# EAGLE design demo3d (EAGLE 5.11)
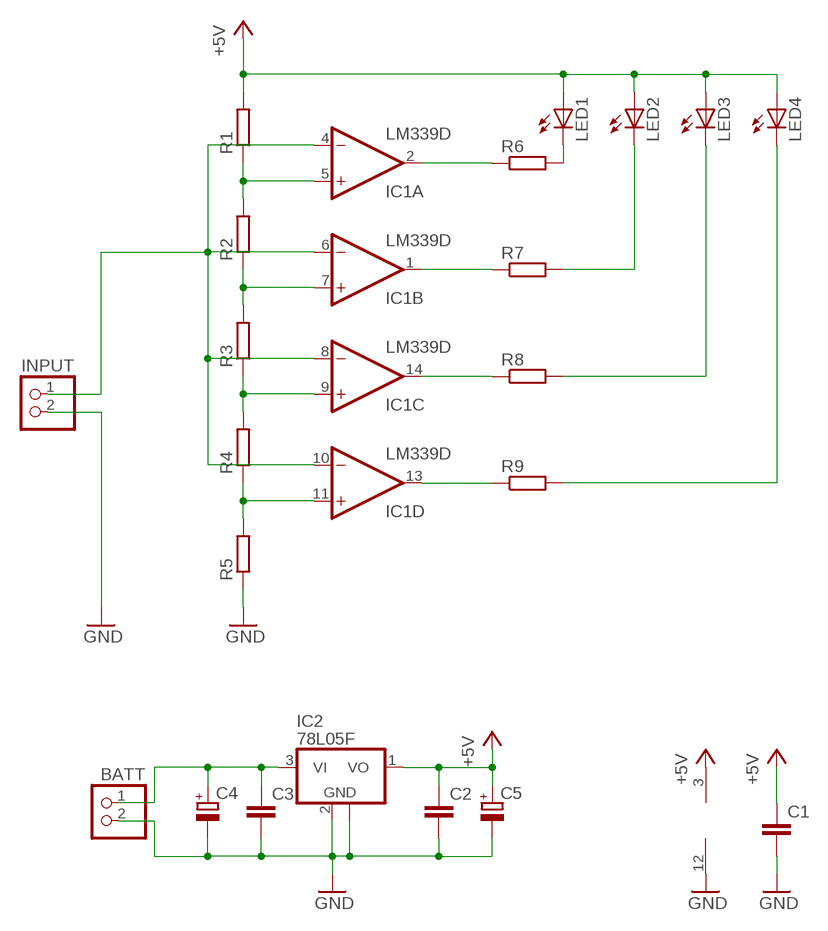
[diagram p0: schematic, sheet 1]

## Parts
BATT  PINHD-1X2  [1X02]
C1  C-EUC1206  [C1206]
C2  C-EUC1206  [C1206]
C3  C-EUC1206  [C1206]
C4  CPOL-EUE5-6  [E5-6]
C5  CPOL-EUE5-6  [E5-6]
IC1  LM339D  [SO14]
IC2  78L05F  [SOT89]
INPUT  PINHD-1X2  [1X02]
LED1  LED3MM  [LED3MM]
LED2  LED3MM  [LED3MM]
LED3  LED3MM  [LED3MM]
LED4  LED3MM  [LED3MM]
R1  R-EU_R1206  [R1206]
R2  R-EU_R1206  [R1206]
R3  R-EU_R1206  [R1206]
R4  R-EU_R1206  [R1206]
R5  R-EU_R1206  [R1206]
R6  R-EU_R1206  [R1206]
R7  R-EU_R1206  [R1206]
R8  R-EU_R1206  [R1206]
R9  R-EU_R1206  [R1206]

## Nets
+5V: C1.1 C2.1 C5.+ IC1.3(P:V+) IC2.1(VO) LED1.A LED2.A LED3.A LED4.A R1.2
GND: BATT.2 C1.2 C2.2 C3.2 C4.- C5.- IC1.12(P:GND) IC2.2(GND) IC2.2@1(GND) INPUT.2 R5.1
N$1: IC1.4(A:-IN) IC1.6(B:-IN) IC1.8(C:-IN) IC1.10(D:-IN) INPUT.1
N$2: IC1.11(D:+IN) R4.1 R5.2
N$3: IC1.9(C:+IN) R3.1 R4.2
N$4: IC1.7(B:+IN) R2.1 R3.2
N$5: IC1.5(A:+IN) R1.1 R2.2
N$6: IC1.1(B:OUT) R7.1
N$7: IC1.13(D:OUT) R9.1
N$8: IC1.14(C:OUT) R8.1
N$9: IC1.2(A:OUT) R6.1
N$10: LED1.K(C) R6.2
N$11: LED2.K(C) R7.2
N$12: LED3.K(C) R8.2
N$13: LED4.K(C) R9.2
N$16: BATT.1 C3.1 C4.+ IC2.3(VI)

## Library data of the parts
BATT INPUT = pinhead:PINHD-1X2: PIN HEADER
C1-C3 = rcl:C-EU: CAPACITOR, European symbol
C4 C5 = rcl:CPOL-EU: POLARIZED CAPACITOR, European symbol
IC1 = linear:LM339: Low Power Low Offset Voltage Quad Comparators with open collector; LM139/LM239/LM339/LM2901/LM3302
IC2 = linear:78L*: POSITOIV-VOLTAGE REGULATORS Output up to 100 mA Source: http://focus.ti.com/lit/ds/symlink/ua78l05.pdf
LED1-LED4 = led:LED: LED OSRAM: - CHIPLED LG R971, LG N971, LY N971, LG Q971, LY Q971, LO R971, LY R971 LH N974, LH R974 LS Q976, LO Q976, LY Q976 LO Q996 - Hyper CHIPLED LW Q18S LB Q993, LB Q99A, LB R99A - SideLED LS A670, LO A670, LY A670, LG A670, LP A670 LB A673, LV A673, LT A673, LW A673 LH A674 LY A675 LS A676, LA A676, LO A676, LY A676, LW A676 LS A679, LY A679, LG A679 - Hyper Micro SIDELED® LS Y876, LA Y876, LO Y876, LY Y876 LT Y87S - SmartLED LW L88C, LW L88S LB L89C, LB L89S, LG L890 LS L89K, LO L89K, LY L89K LS L896, LA L896, LO L896, LY L896 - TOPLED LS T670, LO T670, LY T670, LG T670, LP T670 LSG T670, LSP T670, LSY T670, LOP T670, LYG T670 LG T671, LOG T671, LSG T671 LB T673, LV T673, LT T673, LW T673 LH T674 LS T676, LA T676, LO T676, LY T676, LB T676, LH T676, LSB T676, LW T676 LB T67C, LV T67C, LT T67C, LS T67K, LO T67K, LY T67K, LW E67C LS E67B, LA E67B, LO E67B, LY E67B, LB E67C, LV E67C, LT E67C LW T67C LS T679, LY T679, LG T679 LS T770, LO T770, LY T770, LG T770, LP T770 LB T773, LV T773, LT T773, LW T773 LH T774 LS E675, LA E675, LY E675, LS T675 LS T776, LA T776, LO T776, LY T776, LB T776 LHGB T686 LT T68C, LB T68C - Hyper Mini TOPLED® LB M676 - Mini TOPLED Santana® LG M470 LS M47K, LO M47K, LY M47K Source: http://www.osram.convergy.de LUXEON: - LUMILED® LXK2-PW12-R00, LXK2-PW12-S00, LXK2-PW14-U00, LXK2-PW14-V00 LXK2-PM12-R00, LXK2-PM12-S00, LXK2-PM14-U00 LXK2-PE12-Q00, LXK2-PE12-R00, LXK2-PE12-S00, LXK2-PE14-T00, LXK2-PE14-U00 LXK2-PB12-K00, LXK2-PB12-L00, LXK2-PB12-M00, LXK2-PB14-N00, LXK2-PB14-P00, LXK2-PB14-Q00 LXK2-PR12-L00, LXK2-PR12-M00, LXK2-PR14-Q00, LXK2-PR14-R00 LXK2-PD12-Q00, LXK2-PD12-R00, LXK2-PD12-S00 LXK2-PH12-R00, LXK2-PH12-S00 LXK2-PL12-P00, LXK2-PL12-Q00, LXK2-PL12-R00 Source: www.luxeon.com KINGBRIGHT: KA-3528ASYC Source: www.kingbright.com
R1-R9 = rcl:R-EU_: RESISTOR, European symbol

## Board
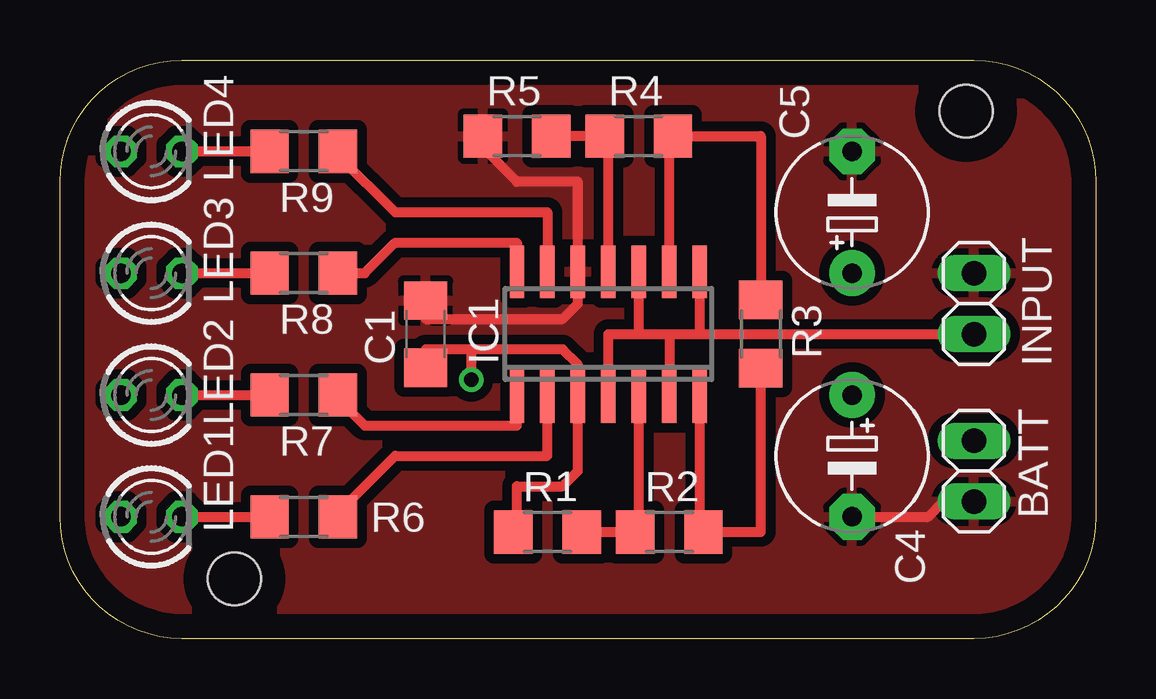
[diagram p1: board, top side]
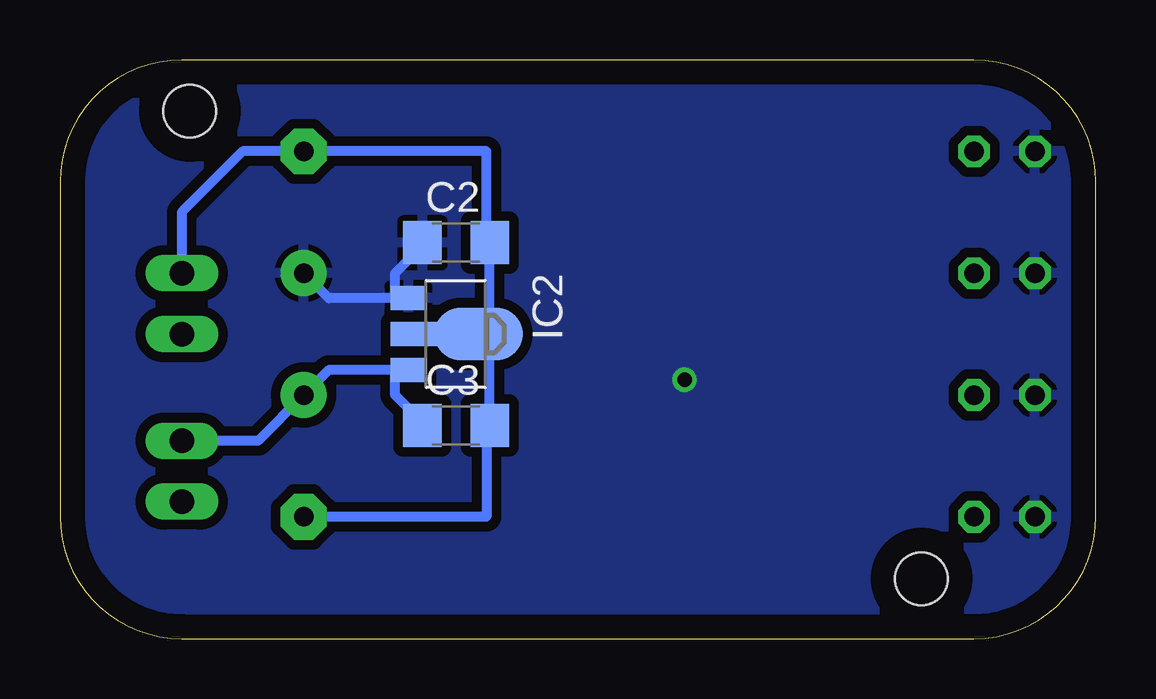
[diagram p2: board, bottom side, seen from below]

Size 43.18 x 24.13 mm. Coordinates in mm from the lower left corner, seen from the top.
Outline: 38.1,24.13 arc-90 43.18,19.05 43.18,5.08 arc-90 38.1,0 5.08,0 arc-90 0,5.08 0,19.05 arc-90 5.08,24.13 38.1,24.13
Copper layers (1*16): Top 0.035mm / dielectric 1.5mm / Bottom 0.035mm
Design rules "default": minimum track width 10mil, minimum drill 24mil, track to track 8mil, track to pad 8mil, pad to pad 8mil, via to via 8mil, smd to smd 8mil, copper to edge 40mil, drill to drill 8mil, minimum pad ring 10mil, minimum via ring 8mil, stop-mask expansion 4mil, vias tented up to drill 0mil, thermal gap 10mil
Holes 2.2 mm at 37.77,22 7.27,2.5

### Footprints (pad centres in the part's own frame; a part is rotated, then mirrored left to right if it is on the bottom)
1X02 = drill 1.016 long: 1 -1.27,0; 2 1.27,0
C1206 = smd 1.6 x 1.8: 1 -1.4,0; 2 1.4,0
E5-6 = drill 0.813 pad 1.905 round: + -2.54,0 | drill 0.813 pad 1.905 octagon: - 2.54,0
SO14 = smd 0.6 x 2.2: 1 -3.81,-2.6; 2 -2.54,-2.6; 3 -1.27,-2.6; 4 0,-2.6; 5 1.27,-2.6; 6 2.54,-2.6; 7 3.81,-2.6; 8 3.81,2.6; 9 2.54,2.6; 10 1.27,2.6; 11 0,2.6; 12 -1.27,2.6; 13 -2.54,2.6; 14 -3.81,2.6
SOT89 = smd 1 x 1.5: 1 -1.499,-1.981; 3 1.499,-1.981 | smd 1 x 2: 2 0,-1.727 | smd 2.2 x 3.7: 2@1 0,0.94
LED3MM = drill 0.813 octagon: A -1.27,0; K 1.27,0
R1206 = smd 1.6 x 1.803: 1 -1.422,0; 2 1.422,0

### Placement (x,y rotation side)
BATT  38.1,6.99 270 top
C1  15.24,12.7 90 top
C2  26.67,16.51 0 bottom
C3  26.67,8.89 0 bottom
C4  33.02,7.62 270 top
C5  33.02,17.78 90 top
IC1  22.86,12.7 0 top
IC2  26.67,12.7 270 bottom
INPUT  38.1,13.97 90 top
LED1  3.81,5.08 0 top
LED2  3.81,10.16 0 top
LED3  3.81,15.24 0 top
LED4  3.81,20.32 0 top
R1  20.32,4.45 180 top
R2  25.4,4.45 180 top
R3  29.21,12.7 270 top
R4  24.13,20.95 0 top
R5  19.05,20.95 0 top
R6  10.16,5.08 180 top
R7  10.16,10.16 180 top
R8  10.16,15.24 180 top
R9  10.16,20.32 180 top

### Tracks (layer width: path | path; a pad name or v marks a point on that pad's centre or on a via)
+5V  (via drill 0.6)
  Top 0.406: 17.14,12.06 20.95,12.06 21.59,11.43 IC1.3 21.59,6.99 20.95,6.35 19.05,6.35 19.05,4.6 R1.2 19.05,4.29 | 17.14,12.06 15.24,12.06 C1.1 | 17.14,12.06 v17.14,10.79
  Bottom 0.406: IC2.1 29.21,14.2 | 29.21,14.2 31.98,14.2 C5.+ | C2.1 28.07,16.38 29.21,15.24 29.21,14.2
  pour Bottom (isolate 0.406): 0,24.13 43.18,24.13 43.18,0 0,0
GND
  Top 0.406: C1.2 15.24,13.34 20.95,13.34 21.59,13.97 IC1.12 21.59,19.05 19.05,19.05 17.63,20.47 R5.1 | C4.- 36.2,5.08 36.83,5.71 BATT.2
  Bottom 0.406: 25.27,13.16 C2.2 25.4,16.64 25.4,20.32 C5.- 35.56,20.32 38.1,17.78 INPUT.2 | IC2.2@1 25.27,13.16 | IC2.2@1 25.4,12.7 25.27,12.57 C3.2 25.4,8.76 25.4,5.08 C4.- | IC2.2@1 26.67,12.7 | 26.67,12.7 IC2.2 | 25.27,13.16 26.21,13.16 26.67,12.7
  pour Top (isolate 0.406): 0,24.13 43.18,24.13 43.18,0 0,0
N$1
  Top 0.406: 24.13,12.7 IC1.10 | 24.13,12.7 25.4,12.7 | 25.4,12.7 26.67,12.7 | 25.4,12.7 IC1.6 | 26.67,12.7 IC1.8 | IC1.4 22.86,12.7 24.13,12.7 | 26.67,12.7 INPUT.1
N$2
  Top 0.406: IC1.11 22.86,20.8 R4.1 R5.2
N$3
  Top 0.406: R3.1 29.21,20.95 R4.2 25.4,20.8 IC1.9
N$4
  Top 0.406: IC1.7 26.67,4.6 R2.1 29.21,4.45 R3.2
N$5
  Top 0.406: IC1.5 24.13,4.6 R2.2 R1.1
N$6
  Top 0.406: IC1.1 19.05,8.89 12.7,8.89 11.58,10.01 R7.1
N$7
  Top 0.406: IC1.13 20.32,17.78 13.97,17.78 11.58,20.17 R9.1
N$8
  Top 0.406: IC1.14 19.05,16.51 13.97,16.51 12.7,15.24 R8.1
N$9
  Top 0.406: IC1.2 20.32,7.62 13.97,7.62 11.58,5.23 R6.1
N$10
  Top 0.406: LED1.K R6.2
N$11
  Top 0.406: LED2.K R7.2
N$12
  Top 0.406: LED3.K R8.2
N$13
  Top 0.406: LED4.K R9.2
N$16
  Bottom 0.406: BATT.1 34.92,8.26 C4.+ 31.98,11.2 29.21,11.2 | 29.21,11.2 IC2.3 | C3.1 28.07,9.02 29.21,10.16 29.21,11.2

### Text on the board
tStop: eagleUp demo file